# EAGLE design TAGPCBv2 (EAGLE 7.4.0)
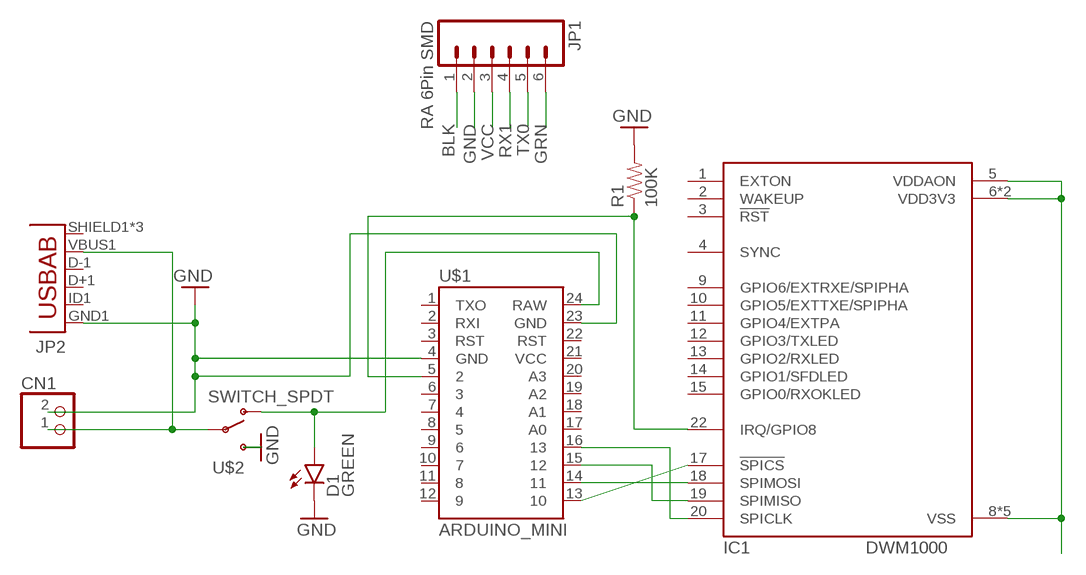
[diagram p0: schematic, sheet 1]

## Parts
CN1  JST_2PIN-SMT-RA  [JST-PH-2-SMT-RA]
D1  GREEN  LED-GREEN0603  [LED-0603]
IC1  DWM1000  [DWM1000]
JP1  RA 6Pin SMD  M06SMD  [1X06-SMD]
JP2  USB-ABCONN-11794  [USB-AB-MICRO-SMD_V03]
R1  100K  RESISTORAXIAL-0.3  [AXIAL-0.3]
U$1  ARDUINO_MINI  [ARDUINO_MINI]
U$2  SWITCH_SPDT  [KPS-1290]

## Nets
BLK: JP1.1
GND: CN1.2 D1.C JP1.2 JP2.GND1(GND) R1.P$2 U$1.4(GND) U$1.23(GND) U$2.S
GRN: JP1.6
N$1: IC1.17(!SPICS) U$1.13
N$2: IC1.22(IRQ/GPIO8) R1.P$1 U$1.5
N$3: IC1.18(SPIMOSI) U$1.14
N$4: IC1.19(SPIMISO) U$1.15
N$5: IC1.20(SPICLK) U$1.16
N$6: D1.A U$1.24(RAW) U$2.O
N$7: CN1.1 JP2.VBUS1(VBUS) U$2.P
N$8: IC1.5(VDDAON) IC1.6(VDD3V3) IC1.7(VDD3V3) IC1.8(VSS) IC1.16(VSS) IC1.21(VSS) IC1.23(VSS) IC1.24(VSS)
RX1: JP1.4
TX0: JP1.5
VCC: JP1.3
Unconnected: IC1.1(EXTON) IC1.2(WAKEUP) IC1.3(!RST) IC1.4(SYNC) IC1.9(GPIO6/EXTRXE/SPIPHA) IC1.10(GPIO5/EXTTXE/SPIPHA) IC1.11(GPIO4/EXTPA) IC1.12(GPIO3/TXLED) IC1.13(GPIO2/RXLED) IC1.14(GPIO1/SFDLED) IC1.15(GPIO0/RXOKLED) JP2.D+1(D+) JP2.D-1(D-) JP2.ID1(USBID) JP2.SHIELD1(SHIELD) JP2.SHIELD2(SHIELD) JP2.SHIELD3(SHIELD) U$1.1(TXO) U$1.2(RXI) U$1.3(RST) U$1.6 U$1.7 U$1.8 U$1.9 U$1.10 U$1.11 U$1.12 U$1.17(A0) U$1.18(A1) U$1.19(A2) U$1.20(A3) U$1.21(VCC) U$1.22(RST)

## Library data of the parts
CN1 = adafruit:JST_2PIN: JST 2-Pin Connectors of various flavors SMT-RA (S2B-PH-SM4) 4UConnector #17311 SMT (B2B-PH-SM4) THM-RA (S2B-PH) THM (B2B-PH)
D1 = SparkFun-LED:LED-GREEN: Various green LEDs Green LEDs used in SFE Production 0603- DIO-00821 LARGE- DIO-00862 LILYPAD- DIO-09910; PROD_ID: DIO-00821
IC1 = decawave:DWM1000
JP1 = SparkFun-Connectors:M06: Header 6 Standard 6-pin 0.1" header. Use with straight break away headers (SKU : PRT-00116), right angle break away headers (PRT-00553), swiss pins (PRT-00743), machine pins (PRT-00117), and female headers (PRT-00115). Molex polarized connector foot print use with SKU : PRT-08094 with associated crimp pins and housings. NOTES ON THE VARIANTS LOCK and LOCK_LONGPADS... This footprint was designed to help hold the alignment of a through-hole component (i.e. 6-pin header) while soldering it into place. You may notice that each hole has been shifted either up or down by 0.005 of an inch from it's more standard position (which is a perfectly straight line). This slight alteration caused the pins (the squares in the middle) to touch the edges of the holes. Because they are alternating, it causes a "brace" to hold the component in place. 0.005 has proven to be the perfect amount of "off-center" position when using our standard breakaway headers. Although looks a little odd when you look at the bare footprint, once you have a header in there, the alteration is very hard to notice. Also,if you push a header all the way into place, it is covered up entirely on the bottom side. This idea of altering the position of holes to aid alignment will be further integrated into the Sparkfun Library for other footprints. It can help hold any component with 3 or more connection pins.; PROD_ID: CONN-08971
JP2 = SparkFun-Connectors:USB-AB: This is a USB AB connector that is compatible with USB OTG. i.e. this connector can serve as a host or device; PROD_ID: CONN-11794
R1 = SparkFun-Resistors:RESISTOR: Resistor Basic schematic elements and footprints for 0603, 1206, and PTH resistors.
U$1 = SparkFun-Boards:ARDUINO_MINI: Arduino Pro Mini footprint
U$2 = SparkFun-Electromechanical:SWITCH_SPDT: SWCH-10651 Side-actuated SPDT slide switch, as used on the Arduino Pro; PROD_ID: SWCH-10651

## Board
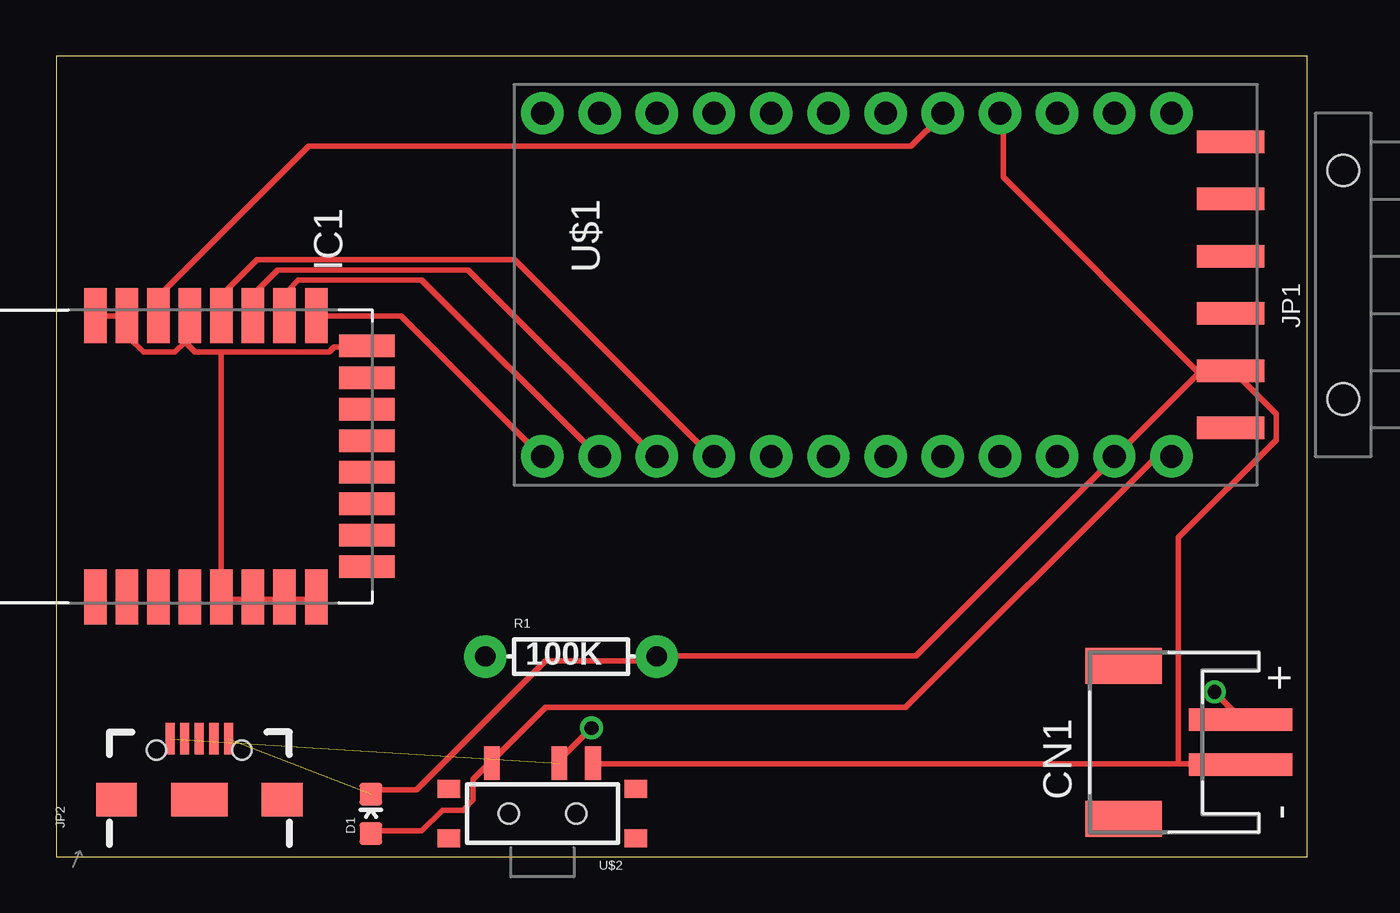
[diagram p1: board, top side]
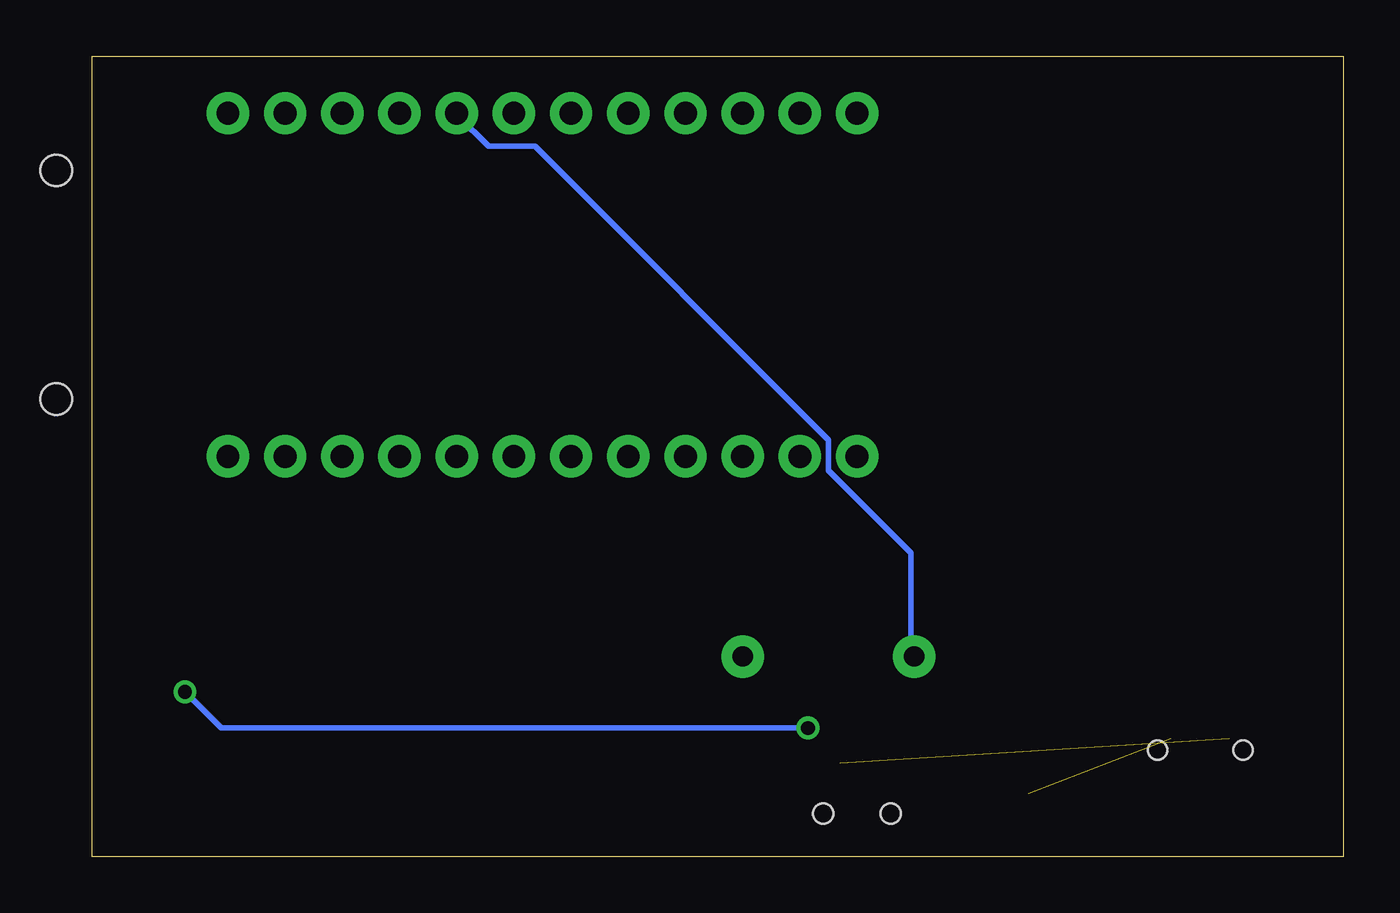
[diagram p2: board, bottom side, seen from below]

Size 55.55 x 35.55 mm. Coordinates in mm from the lower left corner, seen from the top.
Outline: 0,0 55.55,0 55.55,35.55 0,35.55 0,0
Copper layers (1+2*15+16): Top 0.035mm / dielectric 1.5mm / layer 2 0.035mm / dielectric 0.15mm / layer 15 0.035mm / dielectric 0.2mm / Bottom 0.035mm
Design rules "default *": minimum track width 10mil, minimum drill 24mil, track to track 8mil, track to pad 8mil, pad to pad 8mil, via to via 8mil, smd to smd 8mil, copper to edge 40mil, drill to drill 8mil, minimum pad ring 10mil, minimum via ring 8mil, stop-mask expansion 4mil, vias tented up to drill 0mil, thermal gap 10mil

### Footprints (pad centres in the part's own frame; a part is rotated, then mirrored left to right if it is on the bottom)
JST-PH-2-SMT-RA = smd 1 x 4.6: 1 1,-3.7; 2 -1,-3.7 | smd 1.6 x 3.4: NC1 -3.4,1.5; NC2 3.4,1.5
LED-0603 = smd 1 x 1: A 0,-0.877; C 0,0.877
DWM1000 = smd 2.45 x 1: 1 -6.25,0.8; 2 -6.25,-0.6; 3 -6.25,-2; 4 -6.25,-3.4; 5 -6.25,-4.8; 6 -6.25,-6.2; 7 -6.25,-7.6; 8 -6.25,-9; 17 6.25,-9; 18 6.25,-7.6; 19 6.25,-6.2; 20 6.25,-4.8; 21 6.25,-3.4; 22 6.25,-2; 23 6.25,-0.6; 24 6.25,0.8 | smd 1 x 2.45: 9 -4.9,-11.25; 10 -3.5,-11.25; 11 -2.1,-11.25; 12 -0.7,-11.25; 13 0.7,-11.25; 14 2.1,-11.25; 15 3.5,-11.25; 16 4.9,-11.25
1X06-SMD = smd 1 x 3: 1 -6.35,5; 2 -3.81,5; 3 -1.27,5; 4 1.27,5; 5 3.81,5; 6 6.35,5 | hole 1.4: -5.08,0; 5.08,0
USB-AB-MICRO-SMD_V03 = smd 1.4 x 0.4: D+1 2.7,0; D-1 2.7,0.65; GND1 2.7,-1.3; ID1 2.7,-0.65; VBUS1 2.7,1.3 | smd 1.5 x 1.8: SHIELD1 0,3.68; SHIELD3 0,-3.68 | smd 1.5 x 2.5: SHIELD2 0,0 | hole 0.85: 2.2,1.9; 2.2,-1.9
AXIAL-0.3 = drill 0.9 pad 1.88: P$1 -3.81,0; P$2 3.81,0
ARDUINO_MINI = drill 1.016 pad 1.88: 1 -7.62,12.7; 2 -7.62,10.16; 3 -7.62,7.62; 4 -7.62,5.08; 5 -7.62,2.54; 6 -7.62,0; 7 -7.62,-2.54; 8 -7.62,-5.08; 9 -7.62,-7.62; 10 -7.62,-10.16; 11 -7.62,-12.7; 12 -7.62,-15.24; 13 7.62,-15.24; 14 7.62,-12.7; 15 7.62,-10.16; 16 7.62,-7.62; 17 7.62,-5.08; 18 7.62,-2.54; 19 7.62,0; 20 7.62,2.54; 21 7.62,5.08; 22 7.62,7.62; 23 7.62,10.16; 24 7.62,12.7
KPS-1290 = smd 0.7 x 1.5: O -2.25,2.25; P 0.75,2.25; S 2.25,2.25 | smd 1 x 0.8: P$1 -4.15,1.1; P$2 -4.15,-1.1; P$3 4.15,-1.1; P$4 4.15,1.1 | hole 0.9: -1.5,0; 1.5,0

### Placement (x,y rotation side)
CN1  48.9,5.08 90 top
D1  13.97,1.91 0 top
IC1  2.54,17.78 90 top
JP1  57.15,25.4 90 top
JP2  6.35,2.54 90 top
R1  22.86,8.89 0 top
U$1  36.83,25.4 270 top
U$2  21.59,1.91 0 top

### Tracks (layer width: path | path; a pad name or v marks a point on that pad's centre or on a via)
GND  (1 unrouted)
  Top 0.254: 49.84,4.12 52.58,4.12 CN1.2 | 49.84,4.12 24,4.12 U$2.S | D1.C 14.17,2.97 16,2.97 21.72,8.69 26.52,8.69 R1.P$2 26.75,8.91 38.18,8.91 46.86,17.6 U$1.23 47.09,17.83 50.75,21.49 | 50.75,21.49 52.12,21.49 JP1.2 | 50.75,21.49 42.06,30.18 42.06,32.92 U$1.4 | 50.75,21.49 JP1.2 | 49.84,4.12 49.84,14.17 54.18,18.52 54.18,19.66 52.35,21.49 JP1.2
N$1
  Top 0.254: IC1.17 11.66,24 15.32,24 21.49,17.83 U$1.13
N$2
  Top 0.254: IC1.22 4.57,24.23 4.57,24.92 11.2,31.55 37.95,31.55 39.32,32.92 U$1.5
  Bottom 0.254: R1.P$1 19.2,8.91 19.2,13.49 22.86,17.14 22.86,18.52 35.89,31.55 37.95,31.55 39.32,32.92 U$1.5
N$3
  Top 0.254: IC1.18 10.29,24.23 10.29,25.15 10.74,25.6 16.23,25.6 24,17.83 U$1.14
N$4
  Top 0.254: IC1.19 8.91,24.23 8.91,25.15 9.83,26.06 18.29,26.06 26.52,17.83 U$1.15
N$5
  Top 0.254: IC1.20 7.54,24.23 7.54,25.15 8.91,26.52 20.34,26.52 29.03,17.83 U$1.16
N$6
  Top 0.254: D1.A 14.17,1.14 16.23,1.14 17.14,2.06 18.06,2.06 18.52,2.52 18.52,3.43 19.2,4.12 U$2.O 19.43,4.34 21.72,6.63 37.72,6.63 48.69,17.6 49.38,17.6 U$1.24
N$7  (via drill 0.61)  (1 unrouted)
  Top 0.254: v23.77,5.71 22.4,4.34 U$2.P | v51.44,7.32 52.58,6.17 CN1.1
  Bottom 0.254: v23.77,5.71 49.84,5.71 v51.44,7.32
N$8
  Top 0.254: IC1.8 11.43,11.43 10.29,11.43 IC1.7 10.06,11.43 8.91,11.43 IC1.6 8.69,11.43 7.54,11.43 IC1.5 7.32,11.66 7.32,22.4 | IC1.24 1.83,24 2.97,24 IC1.23 3.2,24 3.2,23.09 3.89,22.4 5.26,22.4 5.71,22.86 | 5.71,22.86 5.71,24 IC1.21 5.71,22.86 | 7.32,22.4 6.17,22.4 5.71,22.86 | 7.32,22.4 12.12,22.4 12.34,22.63 13.72,22.63 IC1.16